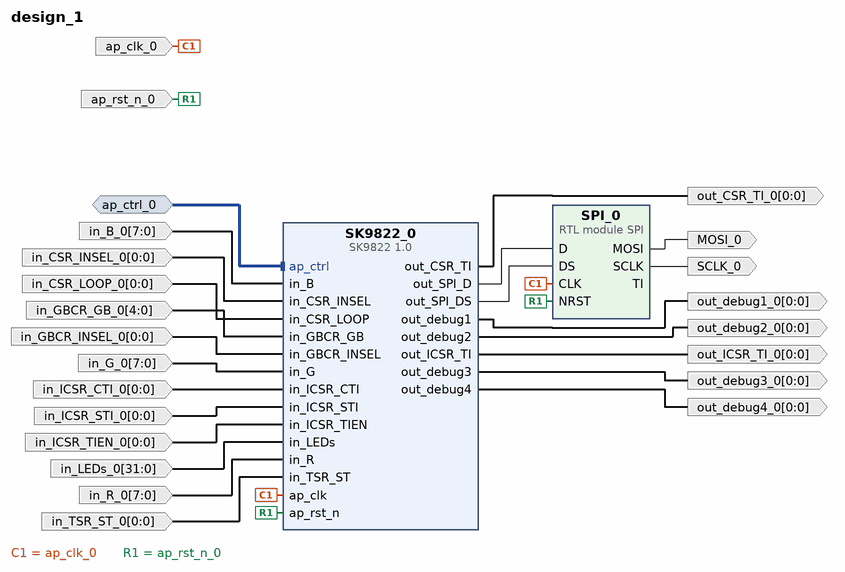
[diagram p0: block diagram of the top level]
# Vivado block design design_1, xc7z020clg400-1, Vivado 2023.2
create_bd_design design_1

create_bd_intf_port -mode Slave -vlnv xilinx.com:interface:acc_handshake_rtl:1.0 ap_ctrl_0
create_bd_port -dir I -type clk ap_clk_0
create_bd_port -dir I -type rst ap_rst_n_0
create_bd_port -dir O SCLK_0
create_bd_port -dir O MOSI_0
create_bd_port -dir O -from 0 -to 0 -type data out_CSR_TI_0
create_bd_port -dir O -from 0 -to 0 -type data out_ICSR_TI_0
create_bd_port -dir O -from 0 -to 0 -type data out_debug1_0
create_bd_port -dir O -from 0 -to 0 -type data out_debug2_0
create_bd_port -dir O -from 0 -to 0 -type data out_debug3_0
create_bd_port -dir O -from 0 -to 0 -type data out_debug4_0
create_bd_port -dir I -from 0 -to 0 -type data in_CSR_INSEL_0
create_bd_port -dir I -from 0 -to 0 -type data in_CSR_LOOP_0
create_bd_port -dir I -from 0 -to 0 -type data in_TSR_ST_0
create_bd_port -dir I -from 0 -to 0 -type data in_GBCR_INSEL_0
create_bd_port -dir I -from 4 -to 0 -type data in_GBCR_GB_0
create_bd_port -dir I -from 0 -to 0 -type data in_ICSR_TIEN_0
create_bd_port -dir I -from 7 -to 0 -type data in_B_0
create_bd_port -dir I -from 7 -to 0 -type data in_G_0
create_bd_port -dir I -from 0 -to 0 -type data in_ICSR_CTI_0
create_bd_port -dir I -from 0 -to 0 -type data in_ICSR_STI_0
create_bd_port -dir I -from 7 -to 0 -type data in_R_0
create_bd_port -dir I -from 31 -to 0 -type data in_LEDs_0

create_bd_cell -type module -reference SPI SPI_0
create_bd_cell -type ip -vlnv xilinx.com:hls:SK9822:1.0 SK9822_0

# ---- connections ----

connect_bd_intf_net -intf_net ap_ctrl_0_1 [get_bd_intf_ports ap_ctrl_0] [get_bd_intf_pins SK9822_0/ap_ctrl]
connect_bd_net [get_bd_pins SK9822_0/out_CSR_TI] [get_bd_ports out_CSR_TI_0]
connect_bd_net [get_bd_pins SK9822_0/out_ICSR_TI] [get_bd_ports out_ICSR_TI_0]
connect_bd_net [get_bd_pins SK9822_0/out_SPI_D] [get_bd_pins SPI_0/D]
connect_bd_net [get_bd_pins SK9822_0/out_SPI_DS] [get_bd_pins SPI_0/DS]
connect_bd_net [get_bd_pins SK9822_0/out_debug1] [get_bd_ports out_debug1_0]
connect_bd_net [get_bd_pins SK9822_0/out_debug2] [get_bd_ports out_debug2_0]
connect_bd_net [get_bd_pins SK9822_0/out_debug3] [get_bd_ports out_debug3_0]
connect_bd_net [get_bd_pins SK9822_0/out_debug4] [get_bd_ports out_debug4_0]
connect_bd_net [get_bd_pins SPI_0/MOSI] [get_bd_ports MOSI_0]
connect_bd_net [get_bd_pins SPI_0/SCLK] [get_bd_ports SCLK_0]
# net SPI_0_TI has one end: SPI_0/TI
connect_bd_net -net ap_clk_0_1 [get_bd_ports ap_clk_0] [get_bd_pins SPI_0/CLK] [get_bd_pins SK9822_0/ap_clk]
connect_bd_net -net ap_rst_n_0_1 [get_bd_ports ap_rst_n_0] [get_bd_pins SPI_0/NRST] [get_bd_pins SK9822_0/ap_rst_n]
connect_bd_net -net in_B_0_1 [get_bd_ports in_B_0] [get_bd_pins SK9822_0/in_B]
connect_bd_net -net in_CSR_INSEL_0_1 [get_bd_ports in_CSR_INSEL_0] [get_bd_pins SK9822_0/in_CSR_INSEL]
connect_bd_net -net in_CSR_LOOP_0_1 [get_bd_ports in_CSR_LOOP_0] [get_bd_pins SK9822_0/in_CSR_LOOP]
connect_bd_net -net in_GBCR_GB_0_1 [get_bd_ports in_GBCR_GB_0] [get_bd_pins SK9822_0/in_GBCR_GB]
connect_bd_net -net in_GBCR_INSEL_0_1 [get_bd_ports in_GBCR_INSEL_0] [get_bd_pins SK9822_0/in_GBCR_INSEL]
connect_bd_net -net in_G_0_1 [get_bd_ports in_G_0] [get_bd_pins SK9822_0/in_G]
connect_bd_net -net in_ICSR_CTI_0_1 [get_bd_ports in_ICSR_CTI_0] [get_bd_pins SK9822_0/in_ICSR_CTI]
connect_bd_net -net in_ICSR_STI_0_1 [get_bd_ports in_ICSR_STI_0] [get_bd_pins SK9822_0/in_ICSR_STI]
connect_bd_net -net in_ICSR_TIEN_0_1 [get_bd_ports in_ICSR_TIEN_0] [get_bd_pins SK9822_0/in_ICSR_TIEN]
connect_bd_net -net in_LEDs_0_1 [get_bd_ports in_LEDs_0] [get_bd_pins SK9822_0/in_LEDs]
connect_bd_net -net in_R_0_1 [get_bd_ports in_R_0] [get_bd_pins SK9822_0/in_R]
connect_bd_net -net in_TSR_ST_0_1 [get_bd_ports in_TSR_ST_0] [get_bd_pins SK9822_0/in_TSR_ST]

validate_bd_design
save_bd_design
